# Altium schematic sheet Alimentation.SchDoc
size 408 x 276 mm; SheetNumber: 3; SheetTotal: 3
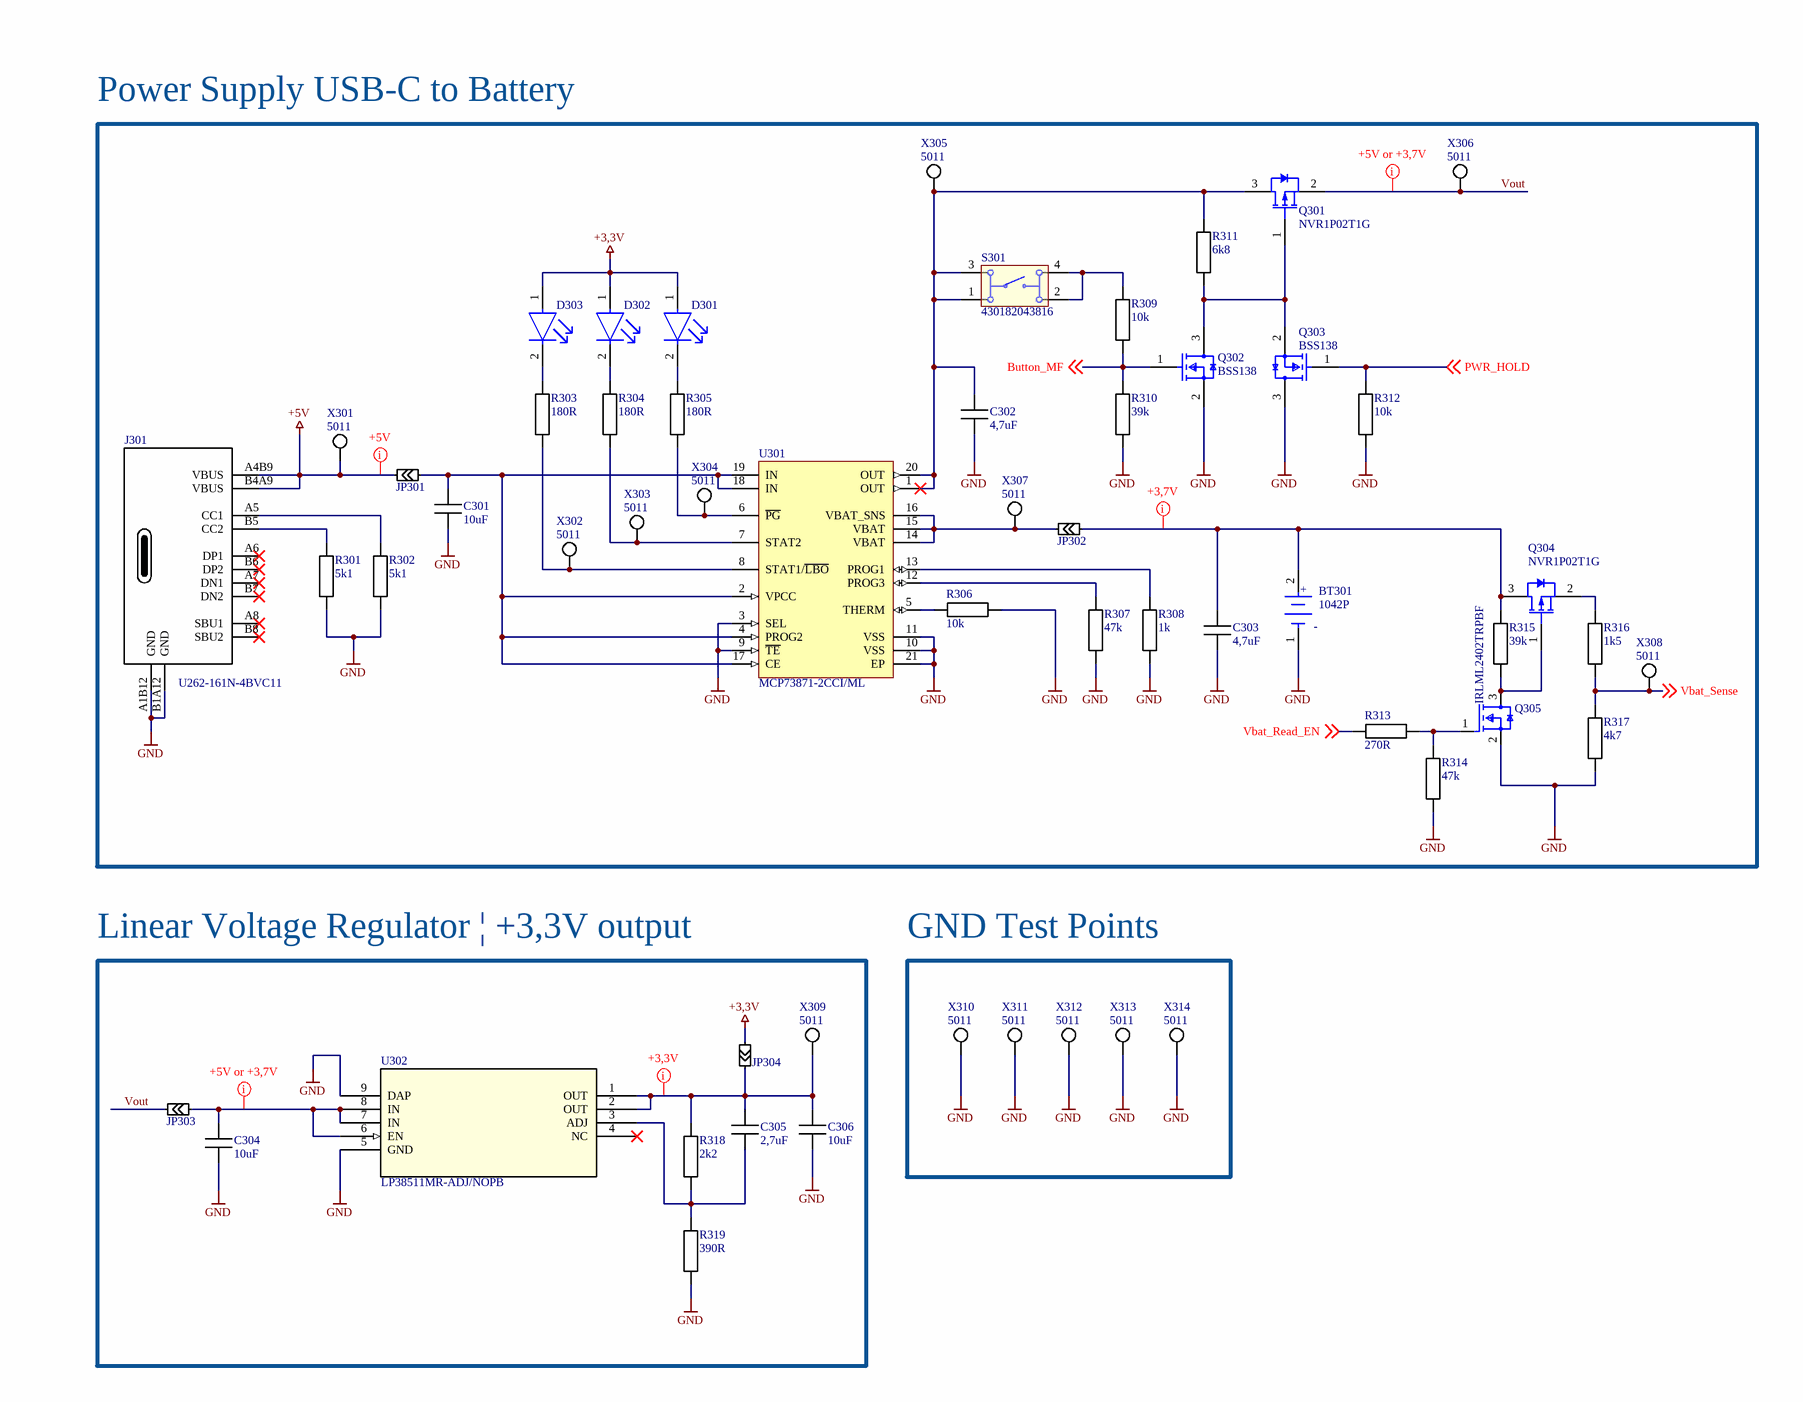
[diagram p0: Alimentation.SchDoc, right]

## Parts
BT301  1042P  [FP-1042P-MFG]
C301  10uF  [CAPC2012X08M]
C302  4,7uF  [CAPC2012X08M]
C303  4,7uF  [CAPC2012X08M]
C304  10uF  [CAPC2012X08M]
C305  2,7uF  [CAPC2012X08M]
C306  10uF  [CAPC2012X08M]
D301  LH R974-LP-1  [FP-LH_R974-MFG]  (value not drawn)
D302  LH R974-LP-1  [FP-LH_R974-MFG]  (value not drawn)
D303  LH R974-LP-1  [FP-LH_R974-MFG]  (value not drawn)
J301  U262-161N-4BVC11  [GCT_USB4105-GF-A]
JP301  Jumper Pad  [Jumper SMD]  (value not drawn)
JP302  Jumper Pad  [Jumper SMD]  (value not drawn)
JP303  Jumper Pad  [Jumper SMD]  (value not drawn)
JP304  Jumper Pad  [Jumper SMD]  (value not drawn)
Q301  NVR1P02T1G  [SOT95P237X112-3N]
Q302  BSS138  [SOT95P237X112-3N]
Q303  BSS138  [SOT95P237X112-3N]
Q304  NVR1P02T1G  [SOT95P237X112-3N]
Q305  IRLML2402TRPBF  [SOT95P237X112-3N]
R301  5k1  [RESC2012X06M]
R302  5k1  [RESC2012X06M]
R303  180R  [RESC2012X06M]
R304  180R  [RESC2012X06M]
R305  180R  [RESC2012X06M]
R306  10k  [RESC2012X06M]
R307  47k  [RESC2012X06M]
R308  1k  [RESC2012X06M]
R309  10k  [RESC2012X06M]
R310  39k  [RESC2012X06M]
R311  6k8  [RESC2012X06M]
R312  10k  [RESC2012X06M]
R313  270R  [RESC2012X06M]
R314  47k  [RESC2012X06M]
R315  39k  [RESC2012X06M]
R316  1k5  [RESC2012X06M]
R317  4k7  [RESC2012X06M]
R318  2k2  [RESC2012X06M]
R319  390R  [RESC2012X06M]
S301  430182043816  [430182043816]
U301  MCP73871-2CCI/ML  [QFN-ML20_M]
U302  LP38511MR-ADJ/NOPB  [MRA08B]
X301  5011  [Keystone_5011]
X302  5011  [Keystone_5011]
X303  5011  [Keystone_5011]
X304  5011  [Keystone_5011]
X305  5011  [Keystone_5011]
X306  5011  [Keystone_5011]
X307  5011  [Keystone_5011]
X308  5011  [Keystone_5011]
X309  5011  [Keystone_5011]
X310  5011  [Keystone_5011]
X311  5011  [Keystone_5011]
X312  5011  [Keystone_5011]
X313  5011  [Keystone_5011]
X314  5011  [Keystone_5011]

## Blocks framed on the sheet
Power Supply USB-C to Battery: BT301 C301-C303 D301-D303 J301 JP301 JP302 Q301-Q305 R301-R317 S301 U301 X301-X308
Linear Voltage Regulator | +3,3V output: C304-C306 JP303 JP304 R318 R319 U302 X309
GND Test Points: X310-X314

## Nets
+3,3V: D301.1(A) D302.1(A) D303.1(A) JP304.2
+5V: J301.A4B9(VBUS) J301.B4A9(VBUS) JP301.1 X301.1(TP)
GND: BT301.1(C) C301.1 C302.1 C303.1 C304.1 C306.1 J301.A1B12(GND) J301.B1A12(GND) Q302.2(S) Q303.3(D) Q305.2(S) R301.1 R302.1 R306.1 R307.2 R308.1 R310.1 R312.2 R314.1 R317.1 R319.1 U301.3(SEL) U301.9(~{TE}) U301.10(VSS) U301.11(VSS) U301.21(EP) U302.5(GND) U302.9(DAP) X310.1(TP) X311.1(TP) X312.1(TP) X313.1(TP) X314.1(TP)
Button_MF: Q302.1(G) R309.2 R310.2 ; off-sheet Button_MF
PWR_HOLD: Q303.1(G) R312.1 ; off-sheet PWR_HOLD
Vbat_Read_EN: R313.2 ; off-sheet Vbat_Read_EN
Vbat_Sense: R316.1 R317.2 X308.1(TP) ; off-sheet Vbat_Sense
Vout: JP303.1 Q301.2(S) X306.1(TP)
NetBT301_2: BT301.2(A) C303.2 JP302.2 Q304.3(D) R315.2
NetC301_2: C301.2 JP301.2 U301.2(VPCC) U301.4(PROG2) U301.17(CE) U301.18(IN) U301.19(IN)
NetC302_2: C302.2 Q301.3(D) R311.2 S301.1 S301.3 U301.1(OUT) U301.20(OUT) X305.1(TP)
NetC304_2: C304.2 JP303.2 U302.6(EN) U302.7(IN) U302.8(IN)
NetC305_1: C305.1 R318.1 R319.2 U302.3(ADJ)
NetC305_2: C305.2 C306.2 JP304.1 R318.2 U302.1(OUT) U302.2(OUT) X309.1(TP)
NetD301_2: D301.2(C) R305.2
NetD302_2: D302.2(C) R304.2
NetD303_2: D303.2(C) R303.2
NetJ301_A5: J301.A5(CC1) R302.2
NetJ301_B5: J301.B5(CC2) R301.2
NetJP302_1: JP302.1 U301.14(VBAT) U301.15(VBAT) U301.16(VBAT_SNS) X307.1(TP)
NetQ301_1: Q301.1(G) Q302.3(D) Q303.2(S) R311.1
NetQ304_1: Q304.1(G) Q305.3(D) R315.1
NetQ304_2: Q304.2(S) R316.2
NetQ305_1: Q305.1(G) R313.1 R314.2
NetR303_1: R303.1 U301.8(STAT1/~{LBO}) X302.1(TP)
NetR304_1: R304.1 U301.7(STAT2) X303.1(TP)
NetR305_1: R305.1 U301.6(~{PG}) X304.1(TP)
NetR306_2: R306.2 U301.5(THERM)
NetR307_1: R307.1 U301.12(PROG3)
NetR308_2: R308.2 U301.13(PROG1)
NetR309_1: R309.1 S301.2 S301.4

Not connected (* = marked no-connect by the designer): J301 A6(DP1)* A7(DN1)* A8(SBU1)* B6(DP2)* B7(DN2)* B8(SBU2)*; U302 4(NC)*

## Layout directives
mark named +5V or +3,7V: NetC304_2, Vout
mark named +3,7V: NetBT301_2
mark named +5V: +5V
mark named +3,3V: NetC305_2

## Notes on the sheet
- a
- Dessiné
- A3
- Echelle :
- Mod.
- b
- c
- d
- Contrôlé
- Remplace
- Nb. feuilles
- Feuille n°
- Nom du projet
- No
- (in symbol CMP-19636-000019-1) +; -

## Library data of the parts
BT301 = CMP-19636-000019-1: BATTERY HOLDER 18650 SMD TAB; Number of Cells: 1; Max Operating Temperature: 145°C; Termination: SMD/SMT; Mount: Surface Mount; Min Operating Temperature: -50°C; Package Quantity: 200; Packaging: Tray; Lead Free: Lead Free
C301 C304 C306 = CMP-065-000040-2: CAPC 10uF X5R 16V 10% 2012 (0805 INCH); Manufacturer Number: C2012X5R1C106K085AC; Manufacturer: TDK; IsStocked: 1; Value: 10µF; PN: PN-654987; TemperatureRange: -55°C to +85°C; Tolerance: ±10%; Voltage: 16V; SubCategory: Condensateurs ceramique; Dielectric: X5R; Supplier Part Number 1: FAB.0805_C 10u; Category: Passives; Supplier Price 1: 0.0360; Supplier 1: ETML
C302 C303 = CMP-065-000038-2: CAPC 4,7uF (0805 INCH); Manufacturer Number: C2012X7R1H104K085AA; Manufacturer: TDK; Voltage: 50V; Dielectric: X7R; IsStocked: 1; TemperatureRange: -55°C to +125°C; Tolerance: ±10%; PN: PN-747862; Supplier Part Number 1: FAB.0805_C 100n; Supplier Price 1: 0.0200; Value: 4,7uF; SubCategory: Condensateurs ceramique; Category: Passives; Supplier 1: ETML
C305 = CMP-065-000040-2: CAPC  2,7uF (0805 INCH); Manufacturer Number: C2012X5R1C106K085AC; Manufacturer: TDK; IsStocked: 1; Tolerance: ±10%; Voltage: 16V; PN: PN-654987; Dielectric: X5R; TemperatureRange: -55°C to +85°C; Value: 2,7uF; SubCategory: Condensateurs ceramique; Supplier Part Number 1: FAB.0805_C 10u; Category: Passives; Supplier Price 1: 0.0360; Supplier 1: ETML
D301-D303 = CMP-2000-06540-2: LED RED DIFFUSED 0805 SMD; Number of Elements: 1; Forward Voltage: 2.6V; Viewing Angle: 160°; Reverse Voltage: 5V; Test Current: 20mA; Dominant Wavelength: 645nm; Forward Current: 30mA; Luminous Intensity: 15mcd; Depth: 1.35mm; Min Operating Temperature: -30°C; Length: 2.1mm; Max Operating Temperature: 85°C; Radiation Hardening: No; Packaging: Tape and Reel; Number of Pins: 2; Mount: Surface Mount; Lens Style: Diffused
J301 = USB-C Type 2.0: U262-161N-4BVC11 / XKB Connectivity; ComponentLink1Description: LCSC  C319148; ComponentLink1URL: https://lcsc.com/product-detail/USB-Connectors_XKB-Connectivity-U262-161N-4BVC11_C319148.html; Supplier 1: LCSC; Supplier Part Number 1: C319148
JP301-JP304 = Jumper Pad: SMD Jumper
Q301 Q304 = CMP-1058-00745-1: Power MOSFET, -20 V, -1 A, P-Channel, 3-Pin SOT-23, Pb-Free, Tape and Reel; Manufacturer: On Semiconductor; Ciss Typ (pF): 165; Configuration: Single; VGS(th) Max (V): 2.3; Channel Polarity: P Channel; V(BR)DSS Min (V): 20; ID Max (A): 1; Coss Typ (pF): 110; Qrr Typ (nC): 8; Crss Typ (pF): 35; PD Max (W): 0.4; DatasheetVersion: Rev. 7; ComponentLink1Description: Manufacturer URL; PackageReference: SOT-23-3-318-08; ComponentLink2Description: Datasheet; ComponentLink2URL: http://www.onsemi.cn/pub_link/Collateral/NTR1P02T1-D.PDF; Packing: Tape and Reel; Package Type: SOT-23-3; ComponentLink1URL: http://www.onsemi.com/; RoHS: Pb-Free; PartNumber: NVR1P02T1G; PackageVersion: Rev. AP, 11/2009; PackageDescription: 3-Pin Small Outline Transistor, Body 2.92 x 1.3 mm, Pitch 0.95 mm; ComponentLink3URL: http://www.onsemi.cn/pub_link/Collateral/318-08.PDF; ComponentLink3Description: Package Specification; VGS Max (V): 20; Mounting Technology: Surface Mount; Manufacturer: ON Semiconductor; Manufacturer Part Number: NVR1P02T1G
Q302 Q303 = CMP-07173-000101-1: MOSFET N-CH 50V 220MA SOT-23; Manufacturer: ON Semiconductor / Fairchild; Turn-Off Delay Time: 20ns; Element Configuration: Single; Rds On Max: 3.5R; Gate to Source Voltage (Vgs): 20V; Threshold Voltage: 1.3V; Number of Elements: 1; Power Dissipation: 360mW; Rise Time: 9ns; Turn-On Delay Time: 2.5ns; Input Capacitance: 27pF; On-State Resistance: 6R; Lead Free: Lead Free; Length: 2.92mm; Width: 1.3mm; Drain to Source Breakdown Voltage: 50V; Min Operating Temperature: -55°C; REACH SVHC: No SVHC; Packaging: Tape and Reel; Radiation Hardening: No; Height: 0.93mm; Drain to Source Voltage (Vdss): 50V; Current Rating: 220mA; Voltage Rating (DC): 50V; Weight: 0.03g; Continuous Drain Current (ID): 220mA; Number of Pins: 3; Nominal Vgs: 1.3V; Max Power Dissipation: 360mW; Fall Time: 9ns; Drain to Source Resistance: 3.5R; Contact Plating: Tin; Case/Package: SOT-23; Package Quantity: 1; Dual Supply Voltage: 50V; Mount: Surface Mount; Termination: SMD/SMT; Max Operating Temperature: 150°C; Manufacturer Part Number: BSS138
Q305 = IRLML2402TRPBF: MOSFET N-CH 20V 1.2A SOT-23; Max Power Dissipation: 540mW; Gate to Source Voltage (Vgs): 12V; Drain to Source Resistance: 350mR; Rise Time: 9.5ns; Threshold Voltage: 700mV; Turn-On Delay Time: 2.5ns; Input Capacitance: 110pF; Element Configuration: Single; Power Dissipation: 540W; Turn-Off Delay Time: 9.7ns; Rds On Max: 250mR; REACH SVHC: No SVHC; Mount: Surface Mount; Packaging: Tape and Reel; Height: 0.04inch; Drain to Source Voltage (Vdss): 20V; Length: 0.119inch; Contact Plating: Tin; Continuous Drain Current (ID): 1.2A; Lead Free: Lead Free; Drain to Source Breakdown Voltage: 20V; Max Dual Supply Voltage: 20V; Number of Pins: 3; Halogen Free: Halogen Free; Max Operating Temperature: 150°C; Case/Package: SOT-23; Min Operating Temperature: -55°C; Width: 0.055inch
R301 R302 = CMP-066-000196-2: RES 5.1kohm (0805 INCH); Manufacturer: Yageo; Manufacturer Number: RC0805FR-075K1L; Power: 0.125W; Tolerance: ±1%; IsStocked: 1; PN: PN-467784; TemperatureRange: -55°C to 155°C; Value: 5.1k; Voltage: 150V; TemperatureCoeff: ±200ppm/°C; Supplier Part Number 1: FAB.0805_R 5k1; Supplier Price 1: 0.0800; Supplier 1: ES; Category: Passives; SubCategory: Resistances couche epaisse
R303-R305 = CMP-066-000178-2: RES 180ohm  ±1% 0.125W 2012 (0805 INCH); Manufacturer: Yageo; Manufacturer Number: RC0805FR-07180RL; Value: 180; TemperatureRange: -55°C to 155°C; TemperatureCoeff: ±200ppm/°C; PN: PN-125035; Voltage: 150V; IsStocked: 1; SubCategory: Resistances couche epaisse; Power: 0.125W; Tolerance: ±1%; Supplier 1: ETML; Supplier Price 1: 0.0200; Supplier Part Number 1: FAB.0805_R 180R; Category: Passives
R306 R309 R312 = CMP-066-000199-2: RES 10kohm  ±1% 0.125W 2012 (0805 INCH); Manufacturer Number: RC0805FR-0710KL; Manufacturer: Yageo; PN: PN-374909; TemperatureCoeff: ±200ppm/°C; Voltage: 150V; TemperatureRange: -55°C to 155°C; IsStocked: 1; Tolerance: ±1%; Category: Passives; Value: 10k; Supplier Price 1: 0.0200; Supplier Part Number 1: FAB.0805_R 10k; Supplier 1: ETML; SubCategory: Resistances couche epaisse; Power: 0.125W
R307 R314 = CMP-066-000207-2: RES 47kohm  ±1% 0.125W 2012 (0805 INCH); Manufacturer Number: RC0805FR-0747KL; Manufacturer: Yageo; TemperatureRange: -55°C to 155°C; Voltage: 150V; IsStocked: 1; TemperatureCoeff: ±200ppm/°C; PN: PN-427242; Category: Passives; Supplier Price 1: 0.0200; Power: 0.125W; Supplier 1: ETML; Tolerance: ±1%; SubCategory: Resistances couche epaisse; Supplier Part Number 1: FAB.0805_R 47k; Value: 47k
R308 = CMP-066-000187-2: RES 1.0kohm  ±1% 0.125W 2012 (0805 INCH); Manufacturer: Yageo; Manufacturer Number: RC0805FR-071KL; PN: PN-746409; TemperatureRange: -55°C to 155°C; IsStocked: 1; TemperatureCoeff: ±200ppm/°C; Voltage: 150V; Supplier 1: ETML; Value: 1k; SubCategory: Resistances couche epaisse; Supplier Price 1: 0.0200; Supplier Part Number 1: FAB.0805_R 1k0; Category: Passives; Tolerance: ±1%; Power: 0.125W
R310 R315 = CMP-066-000206-2: RES 39kohm  ±1% 0.125W 2012 (0805 INCH); Manufacturer: Yageo; Manufacturer Number: RC0805FR-0739KL; IsStocked: 1; TemperatureRange: -55°C to 155°C; TemperatureCoeff: ±200ppm/°C; PN: PN-758200; Voltage: 150V; Category: Passives; Value: 39k; Supplier Price 1: 0.0200; Power: 0.125W; SubCategory: Resistances couche epaisse; Supplier 1: ETML; Tolerance: ±1%; Supplier Part Number 1: FAB.0805_R 39k
R311 = CMP-066-000197-2: RES 6.8kohm  ±1% 0.125W 2012 (0805 INCH); Manufacturer Number: RC0805FR-076K8L; Manufacturer: Yageo; PN: PN-136826; TemperatureRange: -55°C to 155°C; Value: 6.8k; Voltage: 150V; TemperatureCoeff: ±200ppm/°C; IsStocked: 1; Category: Passives; SubCategory: Resistances couche epaisse; Supplier 1: ETML; Supplier Price 1: 0.0200; Power: 0.125W; Supplier Part Number 1: FAB.0805_R 6k8; Tolerance: ±1%
R313 = CMP-066-000180-2: RES 270ohm  ±1% 0.125W 2012 (0805 INCH); Manufacturer Number: RC0805FR-07270RL; Manufacturer: Yageo; Voltage: 150V; IsStocked: 1; Value: 270; TemperatureRange: -55°C to 155°C; TemperatureCoeff: ±200ppm/°C; PN: PN-363118; SubCategory: Resistances couche epaisse; Supplier Part Number 1: FAB.0805_R 270R; Category: Passives; Power: 0.125W; Supplier 1: ETML; Supplier Price 1: 0.0200; Tolerance: ±1%
R316 = CMP-066-000189-2: RES 1.5kohm  ±1% 0.125W 2012 (0805 INCH); Manufacturer Number: RC0805FR-071K5L; Manufacturer: Yageo; PN: PN-984492; Value: 1.5k; TemperatureRange: -55°C to 155°C; TemperatureCoeff: ±200ppm/°C; IsStocked: 1; Voltage: 150V; Supplier Price 1: 0.0200; Supplier Part Number 1: FAB.0805_R 1k5; Power: 0.125W; Supplier 1: ETML; Tolerance: ±1%; SubCategory: Resistances couche epaisse; Category: Passives
R317 = CMP-066-000195-2: RES 4.7kohm  ±1% 0.125W 2012 (0805 INCH); Manufacturer: Yageo; Manufacturer Number: RC0805FR-074K7L; Value: 4.7k; Voltage: 150V; IsStocked: 1; PN: PN-798742; TemperatureCoeff: ±200ppm/°C; TemperatureRange: -55°C to 155°C; Power: 0.125W; Supplier Price 1: 0.0200; Category: Passives; Supplier Part Number 1: FAB.0805_R 4k7; Supplier 1: ETML; SubCategory: Resistances couche epaisse; Tolerance: ±1%
R318 = CMP-066-000191-2: RES 2.2kohm  ±1% 0.125W 2012 (0805 INCH); Manufacturer Number: RC0805FR-072K2L; Manufacturer: Yageo; IsStocked: 1; Voltage: 150V; PN: PN-322576; Value: 2.2k; TemperatureCoeff: ±200ppm/°C; TemperatureRange: -55°C to 155°C; Supplier Price 1: 0.0200; SubCategory: Resistances couche epaisse; Supplier 1: ETML; Tolerance: ±1%; Category: Passives; Power: 0.125W; Supplier Part Number 1: FAB.0805_R 2k2
R319 = CMP-066-000182-2: RES 390ohm  ±1% 0.125W 2012 (0805 INCH); Manufacturer Number: RC0805FR-07390RL; Manufacturer: Yageo; Voltage: 150V; TemperatureCoeff: ±200ppm/°C; TemperatureRange: -55°C to 155°C; IsStocked: 1; Value: 390; PN: PN-601201; Tolerance: ±1%; Power: 0.125W; Supplier Part Number 1: FAB.0805_R 390R; Supplier 1: ETML; SubCategory: Resistances couche epaisse; Category: Passives; Supplier Price 1: 0.0200
S301 = CMP-1452-00013-1: WS-TASV SMD Tact Switch 6X6 mm; Manufacturer: Wuerth Elektronik; NoPins: 04; ComponentLink2Description: Datasheet; PackageReference: 430182043816; ComponentLink2URL: http://katalog.we-online.de/em/datasheet/4301x2.pdf; ComponentLink1URL: http://www.we-online.com; PartNumber: 430182043816; ComponentLink1Description: Manufacturer URL
U301 = CMP-0133-00005-1: Stand-Alone System Load Sharing and Li-Ion/Li-Polymer Battery Charge Management Controller, 4.2V, 20-Pin QFN, Industrial Temperature; PackageDescription: 20-Lead Plastic Quad Flat, No Lead Package (ML) - 4x4x0.9 mm Body [QFN]; PackageReference: QFN-ML20; PackageVersion: revBB, Aug-2009; DatasheetVersion: revB, May-2009
U302 = LP38511MR-ADJ/NOPB: No Description Available; Mfr_Name: Texas Instruments; Copyright: Copyright (C) 2023 Ultra Librarian. All rights reserved.; Manufacturer_Part_Number: LP38511MR-ADJ/NOPB; RefDes: RefDes; Type: DEV
X301-X309 = CMP-054-000005-1: TEST THT MULTIPURPOSE BK; Manufacturer: Keystone; IsStocked: True; PN: PN-926990; Supplier 1: ETML; Value: 5011; Manufacturer Number: 5011; Supplier Part Number 1: MAG.428.014; Category: Connectors; SubCategory: Testpoints; Supplier Price 1: 0.2439
X310-X314 = Test Point 5011: TEST THT MULTIPURPOSE BK, CMP-054-000005-1; Manufacturer: Keystone; Manufacturer: Keystone Electronics; IsStocked: True; PN: PN-926990; Supplier 1: ETML; Value: 5011; Manufacturer Number: 5011; Supplier Part Number 1: MAG.428.014; Category: Connectors; SubCategory: Testpoints; Supplier Price 1: 0.2439; Manufacturer Part Number: 5011; Component Type: Connectors